# EAGLE schematic BBC_female (EAGLE 9.6.2)
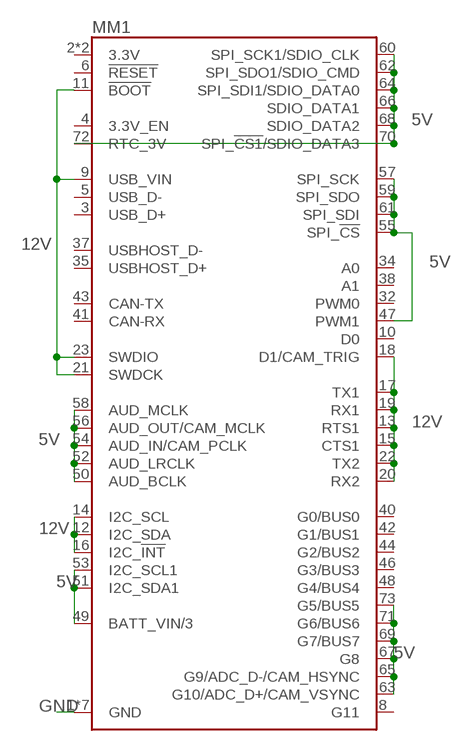
[diagram p0: schematic, sheet 1]

## Parts
MM1  MICROMOD4222  [MICROMOD4222]

## Nets
5V: MM1.47(PWM1) MM1.49(BATT_VIN/3) MM1.50(AUD_BCLK) MM1.51(I2C_SDA1) MM1.52(AUD_LRCLK) MM1.53(I2C_SCL1) MM1.54(AUD_IN/CAM_PCLK) MM1.55(SPI_!CS!) MM1.56(AUD_OUT/CAM_MCLK) MM1.57(SPI_SCK) MM1.58(AUD_MCLK) MM1.59(SPI_SDO) MM1.60(SPI_SCK1/SDIO_CLK) MM1.61(SPI_SDI) MM1.62(SPI_SDO1/SDIO_CMD) MM1.63(G10/ADC_D+/CAM_VSYNC) MM1.64(SPI_SDI1/SDIO_DATA0) MM1.65(G9/ADC_D-/CAM_HSYNC) MM1.66(SDIO_DATA1) MM1.67(G8) MM1.68(SDIO_DATA2) MM1.69(G7/BUS7) MM1.70(SPI_!CS1!/SDIO_DATA3) MM1.71(G6/BUS6) MM1.72(RTC_3V) MM1.73(G5/BUS5)
12V: MM1.9(USB_VIN) MM1.11(!BOOT!) MM1.12(I2C_SDA) MM1.13(RTS1) MM1.14(I2C_SCL) MM1.15(CTS1) MM1.16(I2C_!INT!) MM1.17(TX1) MM1.18(D1/CAM_TRIG) MM1.19(RX1) MM1.20(RX2) MM1.21(SWDCK) MM1.22(TX2) MM1.23(SWDIO)
GND: MM1.1(GND) MM1.7(GND) MM1.33(GND) MM1.36(GND) MM1.39(GND) MM1.45(GND) MM1.75(GND)
Unconnected: MM1.2(3.3V) MM1.3(USB_D+) MM1.4(3.3V_EN) MM1.5(USB_D-) MM1.6(!RESET!) MM1.8(G11) MM1.10(D0) MM1.32(PWM0) MM1.34(A0) MM1.35(USBHOST_D+) MM1.37(USBHOST_D-) MM1.38(A1) MM1.40(G0/BUS0) MM1.41(CAN-RX) MM1.42(G1/BUS1) MM1.43(CAN-TX) MM1.44(G2/BUS2) MM1.46(G3/BUS3) MM1.48(G4/BUS4) MM1.74(3.3V)

## Library data of the parts
MM1 = Micromod_4222_Female:MICROMOD4222